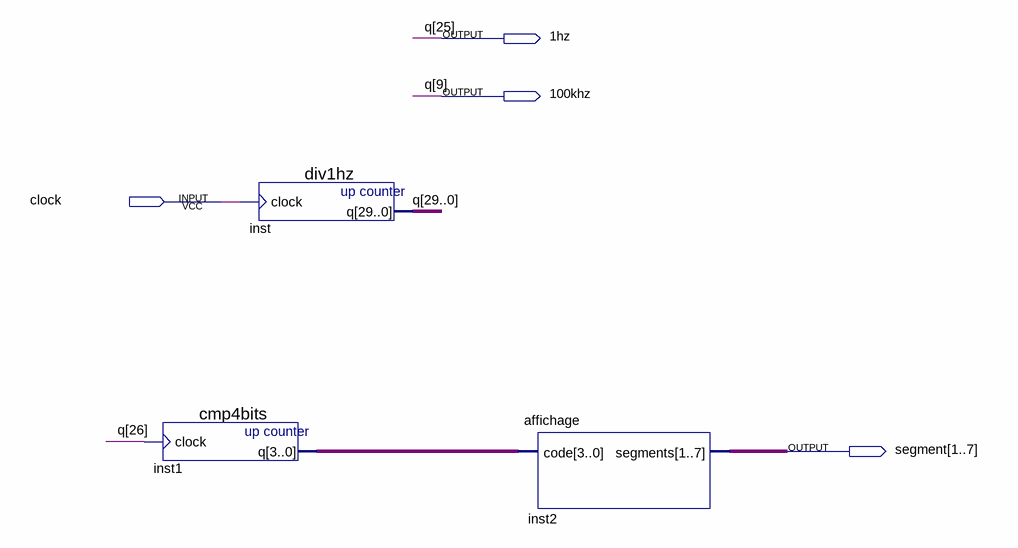
[diagram p0: schematic sheet]
// Quartus schematic diviseur.bdf as structural Verilog: 3 symbols, 4 pins
module diviseur (
  input  clock,
  output \1hz ,
  output \100khz ,
  output [1:7] segment
);

  wire [3:0] inst1_q;
  wire [29:0] q;

  cmp4bits inst1 (.clock(q[26]), .q(inst1_q));
  div1hz inst (.clock(clock), .q({q[29:26], \1hz , q[24:10], \100khz , q[8:0]}));
  affichage inst2 (.code(inst1_q), .segments(segment));

  // Other names for the same wires on the sheet: q (some bits) = {\1hz , \100khz }
endmodule
